# EAGLE design esp32-thing (EAGLE 7.5.0)
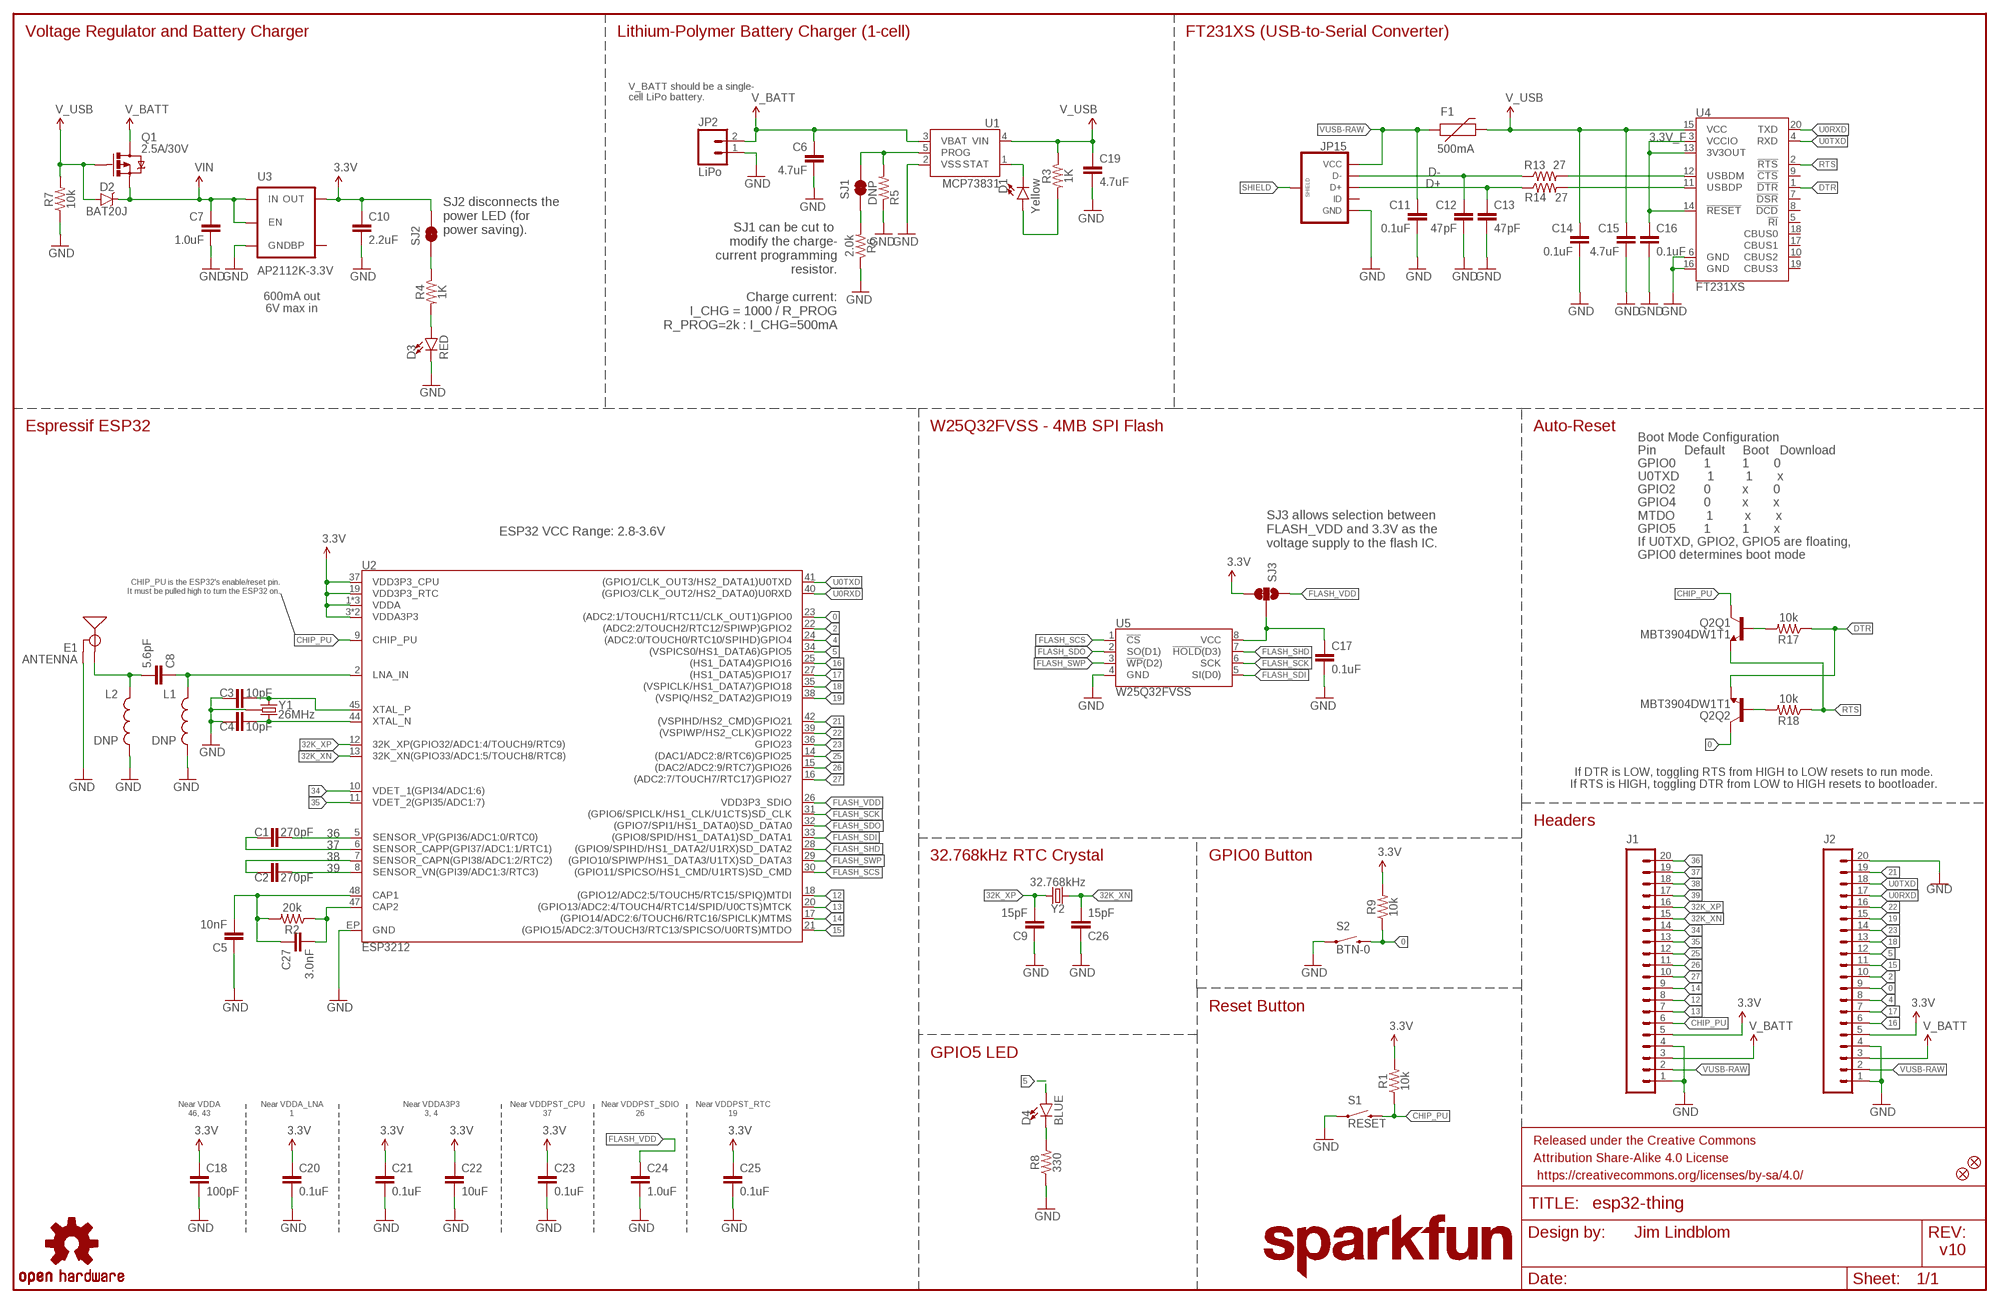
[diagram p0: schematic, sheet 1]

## Parts
C1  270pF  270PF-50V-5%(0603)  [0603]
C2  270pF  270PF-50V-5%(0603)  [0603]
C3  10pF  10PF-0603-50V-5%  [0603]
C4  10pF  10PF-0603-50V-5%  [0603]
C5  10nF  10NF-0603-50V-10%  [0603]
C6  4.7uF  4.7UF0603  [0603]
C7  1.0uF  1.0UF-0805-25V-(+80/-20%)  [0805]
C8  5.6pF  5.6PF-50V-5%(0603)  [0603]
C9  15pF  15PF-0603-50V-5%  [0603]
C10  2.2uF  2.2UF-0603-10V-20%  [0603]
C11  0.1uF  0.1UF-0603-25V-(+80/-20%)  [0603]
C12  47pF  47PF-0603-50V-5%  [0603]
C13  47pF  47PF-0603-50V-5%  [0603]
C14  0.1uF  0.1UF-0603-25V-(+80/-20%)  [0603]
C15  4.7uF  4.7UF-6.3V-10%(0603)0603  [0603-CAP]
C16  0.1uF  0.1UF-0603-25V-(+80/-20%)  [0603]
C17  0.1uF  0.1UF-0603-25V-(+80/-20%)  [0603]
C18  100pF  100PF-0603-50V-5%  [0603]
C19  4.7uF  4.7UF0603  [0603]
C20  0.1uF  0.1UF-0603-25V-(+80/-20%)  [0603]
C21  0.1uF  0.1UF-0603-25V-(+80/-20%)  [0603]
C22  10uF  10UF-0603-6.3V-20%  [0603]
C23  0.1uF  0.1UF-0603-25V-(+80/-20%)  [0603]
C24  1.0uF  1.0UF-0603-16V-10%  [0603]
C25  0.1uF  0.1UF-0603-25V-(+80/-20%)  [0603]
C26  15pF  15PF-0603-50V-5%  [0603]
C27  3.0nF  3.0NF-0603-50V-5%  [0603]
D1  Yellow  LED-YELLOW0603  [LED-0603]
D2  BAT20J  DIODE-SCHOTTKY-BAT20J  [SOD-323]
D3  RED  LED-RED0603  [LED-0603]
D4  BLUE  LED-BLUE0603  [LED-0603]
E1  ANTENNA  ANTENNATRACE-TUNED  [TRACE_ANTENNA_2.4GHZ_25.7MM_TUNED]
F1  500mA  PTCSMD  [PTC-1206]
FD1  FIDUCIALUFIDUCIAL  [MICRO-FIDUCIAL]
FD2  FIDUCIALUFIDUCIAL  [MICRO-FIDUCIAL]
FRAME1  FRAME-LEDGER  [CREATIVE_COMMONS]
J1  M20NOSILK  [1X20_NOSILK]
J2  M20NOSILK  [1X20_NOSILK]
JP2  LiPo  M02JST-PTH-2  [JST-2-PTH]
JP15  USB_MICROB_PLUGCONN-11752  [USB-B-MICRO-SMD_V03]
L1  DNP  INDUCTOR0603  [0603]
L2  DNP  INDUCTOR0603  [0603]
LOGO1  SFE_LOGO_NAME.2_INCH  [SFE_LOGO_NAME_.2]
LOGO2  OSHW-LOGOMINI  [OSHW-LOGO-MINI]
LOGO3  SFE_LOGO_NAME.2_INCH  [SFE_LOGO_NAME_.2]
Q1  2.5A/30V  MOSFET-PCHANNELDMG2307L  [SOT23-3]
Q2  MBT3904DW1T1  [SC70-6]
R1  10k  10KOHM-1/10W-1%(0603)0603  [0603]
R2  20k  20KOHM-0603-1/10W-1%  [0603]
R3  1K  1KOHM-1/10W-1%(0603)  [0603]
R4  1K  1KOHM-1/10W-1%(0603)  [0603]
R5  DNP  RESISTORPTH-1/6W  [1/6W-RES]
R6  2.0k  2.0KOHM1/10W5%(0603)  [0603]
R7  10k  10KOHM-0603-1/10W-1%  [0603]
R8  330  330OHM1/10W1%(0603)  [0603]
R9  10k  10KOHM-1/10W-1%(0603)0603  [0603]
R13  27  27OHM1/10W1%(0603)0603-RES  [0603]
R14  27  27OHM1/10W1%(0603)0603-RES  [0603]
R17  10k  10KOHM-0603-1/10W-1%  [0603]
R18  10k  10KOHM-0603-1/10W-1%  [0603]
S1  RESET  SWITCH-MOMENTARY-2SMD-4.6X2.8MM  [TACTILE_SWITCH_SMD_4.6X2.8MM]
S2  BTN-0  SWITCH-MOMENTARY-2SMD-4.6X2.8MM  [TACTILE_SWITCH_SMD_4.6X2.8MM]
SJ1  JUMPER-PAD-2-NC_BY_TRACE  [PAD-JUMPER-2-NC_BY_TRACE_YES_SILK]
SJ2  JUMPER-PAD-2-NC_BY_TRACE  [PAD-JUMPER-2-NC_BY_TRACE_YES_SILK]
SJ3  JUMPER-PAD-3-2OF3_NC_BY_TRACE_SMALL  [PAD-JUMPER-3-2OF3_NC_BY_TRACE_YES_SILK_FULL_BOX]
U1  MCP73831  [SOT23-5]
U2  ESP3212  [QFN48-0.4MM]
U3  AP2112K-3.3V  V_REG_LDOSMD  [SOT23-5]
U4  FT231XS  [SSOP20_L]
U5  W25Q32FVSS  [SOIC-8]
Y1  26MHz  CRYSTAL-GROUNDED3.2X2.5  [CRYSTAL-SMD-3.2X2.5]
Y2  32.768kHz  CRYSTAL-32.768KHZSMD-3.2X1.5  [CRYSTAL-SMD-3.2X1.5MM]

## Nets
0: J2.9 Q2.6(Q2:C) R9.1 S2.3 S2.4 U2.23((ADC2:1/TOUCH1/RTC11/CLK_OUT1)GPIO0)
2: J2.10 U2.22((ADC2:2/TOUCH2/RTC12/SPIWP)GPIO2)
3.3V: C10.1 C18.1 C20.1 C21.1 C22.1 C23.1 C25.1 J1.5 J2.5 R1.2 R9.2 SJ2.2 SJ3.3 U2.1(VDDA) U2.3(VDDA3P3) U2.4(VDDA3P3) U2.19(VDD3P3_RTC) U2.37(VDD3P3_CPU) U2.43(VDDA) U2.46(VDDA) U3.5(OUT)
3.3V_F: C16.1 U4.3(VCCIO) U4.13(3V3OUT) U4.14(!RESET)
4: J2.8 U2.24((ADC2:0/TOUCH0/RTC10/SPIHD)GPIO4)
5: D4.A J2.12 U2.34((VSPICS0/HS1_DATA6)GPIO5)
12: J1.8 U2.18((GPIO12/ADC2:5/TOUCH5/RTC15/SPIQ)MTDI)
13: J1.7 U2.20((GPIO13/ADC2:4/TOUCH4/RTC14/SPID/U0CTS)MTCK)
14: J1.9 U2.17((GPIO14/ADC2:6/TOUCH6/RTC16/SPICLK)MTMS)
15: J2.11 U2.21((GPIO15/ADC2:3/TOUCH3/RTC13/SPICSO/U0RTS)MTDO)
16: J2.6 U2.25((HS1_DATA4)GPIO16)
17: J2.7 U2.27((HS1_DATA5)GPIO17)
18: J2.13 U2.35((VSPICLK/HS1_DATA7)GPIO18)
19: J2.15 U2.38((VSPIQ/HS2_DATA2)GPIO19)
21: J2.19 U2.42((VSPIHD/HS2_CMD)GPIO21)
22: J2.16 U2.39((VSPIWP/HS2_CLK)GPIO22)
23: J2.14 U2.36(GPIO23)
25: J1.12 U2.14((DAC1/ADC2:8/RTC6)GPIO25)
26: J1.11 U2.15((DAC2/ADC2:9/RTC7)GPIO26)
27: J1.10 U2.16((ADC2:7/TOUCH7/RTC17)GPIO27)
32K_XN: C26.2 J1.15 U2.13(32K_XN(GPIO33/ADC1:5/TOUCH8/RTC8)) Y2.P$2
32K_XP: C9.2 J1.16 U2.12(32K_XP(GPIO32/ADC1:4/TOUCH9/RTC9)) Y2.P$1
34: J1.14 U2.10(VDET_1(GPI34/ADC1:6))
35: J1.13 U2.11(VDET_2(GPI35/ADC1:7))
36: C1.2 J1.20 U2.5(SENSOR_VP(GPI36/ADC1:0/RTC0))
37: C1.1 J1.19 U2.6(SENSOR_CAPP(GPI37/ADC1:1/RTC1))
38: C2.1 J1.18 U2.7(SENSOR_CAPN(GPI38/ADC1:2/RTC2))
39: C2.2 J1.17 U2.8(SENSOR_VN(GPI39/ADC1:3/RTC3))
CAP_10N: C5.2 C27.1 R2.2 U2.48(CAP1)
CHIP_PU: J1.6 Q2.3(Q1:C) R1.1 S1.3 S1.4 U2.9(CHIP_PU)
D+: C13.1 JP15.D+ R14.1
D-: C12.1 JP15.D- R13.1
DTR: Q2.1(Q2:E) R17.1 U4.1(!DTR)
FLASH_SCK: U2.31((GPIO6/SPICLK/HS1_CLK/U1CTS)SD_CLK) U5.6(SCK)
FLASH_SCS: U2.30((GPIO11/SPICSO/HS1_CMD/U1RTS)SD_CMD) U5.1(!CS!)
FLASH_SDI: U2.33((GPIO8/SPID/HS1_DATA1)SD_DATA1) U5.5(SI(D0))
FLASH_SDO: U2.32((GPIO7/SPI1/HS1_DATA0)SD_DATA0) U5.2(SO(D1))
FLASH_SHD: U2.28((GPIO9/SPIHD/HS1_DATA2/U1RX)SD_DATA2) U5.7(!HOLD!(D3))
FLASH_SWP: U2.29((GPIO10/SPIWP/HS1_DATA3/U1TX)SD_DATA3) U5.3(!WP!(D2))
FLASH_VDD: C24.1 SJ3.1 U2.26(VDD3P3_SDIO)
GND: C3.1 C4.1 C5.1 C6.2 C7.2 C9.1 C10.2 C11.2 C12.2 C13.2 C14.2 C15.2 C16.2 C17.2 C18.2 C19.2 C20.2 C21.2 C22.2 C23.2 C24.2 C25.2 C26.1 D3.C E1.GND E1.GND2(GND) J1.1 J1.4 J2.1 J2.4 J2.20 JP2.1 JP15.GND L1.2 L2.2 R5.1 R6.1 R7.1 R8.1 S1.1 S1.2 S2.1 S2.2 U1.2(VSS) U2.EP(GND) U3.2(GND) U4.6(GND) U4.16(GND) U5.4(GND) Y1.2(GND) Y1.4(GND)
LNA_IN: C8.1 L1.1 U2.2(LNA_IN)
N$1: D4.C R8.2
N$2: D3.A R4.2
N$3: R4.1 SJ2.1
N$4: C27.2 R2.1 U2.47(CAP2)
N$7: R13.2 U4.12(USBDM)
N$8: R14.2 U4.11(USBDP)
N$9: D1.C U1.1(STAT)
N$10: Q2.5(Q1:B) R17.2
N$11: C17.1 SJ3.2 U5.8(VCC)
N$12: Q2.2(Q2:B) R18.2
N$13: C3.2 U2.45(XTAL_P) Y1.1
N$14: R5.2 SJ1.2 U1.5(PROG)
N$15: C4.2 U2.44(XTAL_N) Y1.3
N$16: R6.2 SJ1.1
N$17: D1.A R3.2
RTS: Q2.4(Q1:E) R18.1 U4.2(!RTS)
SHIELD: JP15.SHIELD1(SHIELD) JP15.SHIELD2(SHIELD) JP15.SHIELD3(SHIELD)
TRACE_ANT: C8.2 E1.ANT(SIGNAL) L2.1
U0RXD: J2.17 U2.40((GPIO3/CLK_OUT2/HS2_DATA0)U0RXD) U4.20(TXD)
U0TXD: J2.18 U2.41((GPIO1/CLK_OUT3/HS2_DATA1)U0TXD) U4.4(RXD)
V_BATT: C6.1 J1.3 J2.3 JP2.2 Q1.3(D) U1.3(VBAT)
V_USB: C14.1 C15.1 C19.1 D2.A F1.2 Q1.1(G) R3.1 R7.2 U1.4(VIN) U4.15(VCC)
VIN: C7.1 D2.C Q1.2(S) U3.1(IN) U3.3(EN)
VUSB-RAW: C11.1 F1.1 J1.2 J2.2 JP15.VBUS(VCC)
Unconnected: JP15.ID U3.4(BP) U4.5(!RI) U4.7(!DSR) U4.8(!DCD) U4.9(!CTS) U4.10(CBUS2) U4.17(CBUS1) U4.18(CBUS0) U4.19(CBUS3)

## Notes on the sheet
- Voltage Regulator and Battery Charger | Lithium-Polymer Battery Charger (1-cell) | FT231XS (USB-to-Serial Converter)
- V_BATT should be a single-
  cell LiPo battery.
- SJ1 can be cut to 
  modify the charge-
  current programming
  resistor.
- SJ2 disconnects the
  power LED (for 
  power saving).
- 600mA out
  6V max in
- Charge current:
  I_CHG = 1000 / R_PROG
  R_PROG=2k : I_CHG=500mA
- Espressif ESP32 | W25Q32FVSS - 4MB SPI Flash | Auto-Reset
- ESP32 VCC Range: 2.8-3.6V
- SJ3 allows selection between 
  FLASH_VDD and 3.3V as the
  voltage supply to the flash IC.
- Boot Mode Configuration
  Pin        Default     Boot   Download
  GPIO0        1         1       0
  U0TXD        1         1       x
  GPIO2        0         x       0
  GPIO4        0         x       x
  MTDO         1         x       x
  GPIO5        1         1       x
  If U0TXD, GPIO2, GPIO5 are floating, 
  GPIO0 determines boot mode
- CHIP_PU is the ESP32's enable/reset pin.
  It must be pulled high to turn the ESP32 on.
- If DTR is LOW, toggling RTS from HIGH to LOW resets to run mode.
  If RTS is HIGH, toggling DTR from LOW to HIGH resets to bootloader.
- Headers
- 32.768kHz RTC Crystal | GPIO0 Button
- Reset Button
- GPIO5 LED
- Near VDDA
  46, 43
- Near VDDA_LNA
  1
- Near VDDA3P3
  3, 4
- Near VDDPST_CPU
  37
- Near VDDPST_SDIO
  26
- Near VDDPST_RTC
  19
- Jim Lindblom
- v10

## Library data of the parts
C1 C2 = esp32-thing-temp:270PF-50V-5%(0603): CAP-13339; PROD_ID: CAP-13339
C3 C4 = SparkFun-Capacitors:10PF: 10pF ceramic capacitors A capacitor is a passive two-terminal electrical component used to store electrical energy temporarily in an electric field.; PROD_ID: CAP-11812
C5 = SparkFun-Capacitors:10NF: 0.01uF/10nF/10,000pF ceramic capacitors A capacitor is a passive two-terminal electrical component used to store electrical energy temporarily in an electric field. CAP-09321; PROD_ID: CAP-00867
C6 C19 = SparkFun-Capacitors:4.7UF: 4.7µF ceramic capacitors A capacitor is a passive two-terminal electrical component used to store electrical energy temporarily in an electric field.; PROD_ID: CAP-08280
C7 = SparkFun-Capacitors:1.0UF: 1µF ceramic capacitors A capacitor is a passive two-terminal electrical component used to store electrical energy temporarily in an electric field.; PROD_ID: CAP-11625
C8 = esp32-thing-temp:5.6PF-50V-5%(0603): CAP-12456; PROD_ID: CAP-12456
C9 C26 = SparkFun-Capacitors:15PF: 15pF ceramic capacitors A capacitor is a passive two-terminal electrical component used to store electrical energy temporarily in an electric field.; PROD_ID: CAP-07881
C10 = SparkFun-Capacitors:2.2UF: 2.2µF ceramic capacitors A capacitor is a passive two-terminal electrical component used to store electrical energy temporarily in an electric field.; PROD_ID: CAP-07888
C11 C14 C16 C17 C20 C21 C23 C25 = SparkFun-Capacitors:0.1UF: 0.1µF ceramic capacitors A capacitor is a passive two-terminal electrical component used to store electrical energy temporarily in an electric field.; PROD_ID: CAP-00810
C12 C13 = SparkFun-Capacitors:47PF: 47pF ceramic capacitors A capacitor is a passive two-terminal electrical component used to store electrical energy temporarily in an electric field.; PROD_ID: CAP-08913
C15 = SparkFun-Capacitors:4.7UF-6.3V-10%(0603): CAP-08280; PROD_ID: CAP-08280
C18 = SparkFun-Capacitors:100PF: 100pF/0.1nF ceramic capacitors A capacitor is a passive two-terminal electrical component used to store electrical energy temporarily in an electric field.; PROD_ID: CAP-07883
C22 = SparkFun-Capacitors:10UF: 10.0µF ceramic capacitors A capacitor is a passive two-terminal electrical component used to store electrical energy temporarily in an electric field.; PROD_ID: CAP-11015
C24 = SparkFun-Capacitors:1.0UF: 1µF ceramic capacitors A capacitor is a passive two-terminal electrical component used to store electrical energy temporarily in an electric field.; PROD_ID: CAP-00868
C27 = esp32-thing-temp:3.0NF: 3.0nF (3nF, 3000pF) ceramic capacitors A capacitor is a passive two-terminal electrical component used to store electrical energy temporarily in an electric field.; PROD_ID: CAP-13515
D1 = SparkFun-LED:LED-YELLOW: Yellow SMD LEDs LilyPad 1206- DIO-09909 0603- DIO-09003 "SMART" means more efficient and expensive; PROD_ID: DIO-09003
D2 = SparkFun-DiscreteSemi:DIODE-SCHOTTKY: Schottky diodes in SFE's production catalog BAT20J 1A 23V 0.62Vf RB751 120mA 40V 0.37Vf PMEG4005EJ 0.5A 40V 0.42Vf MBRA140 1A 40V 0.5Vf B340A 3A 40V SMA; PROD_ID: DIO-11623
D3 = SparkFun-LED:LED-RED: Red SMD LED Used in manufacturing of most products at SparkFun 0603 - SMD 0603 package Forward Voltage: 1.9V Forward Current: 20mA Datasheet: [Product Link] <http://docs.avagotech.com/docs/AV02-0551EN> 0603 SMART - SMD 0603 SMART package ( more efficient and expensive) Forward Voltage: 1.8V Forward Current: 20mA Datasheet: [Product Link] <http://www.osram-os.com/Graphics/XPic2/00077099_0.pdf> 1206 - SMD 1206 package Forward Voltage: 2V Forward Current: 20mA Datasheet: [Product Link] <https://www.sparkfun.com/datasheets/DevTools/LilyPad/Q150OVS4.pdff> 1206 LilyPad - SMD 1206 LilyPad package Forward Voltage: 2V Forward Current: 20mA Datasheet: [Product Link] <https://www.sparkfun.com/datasheets/DevTools/LilyPad/Q150OVS4.pdf>; PROD_ID: DIO-00819
D4 = SparkFun-LED:LED-BLUE: Blue SMD LED Used in manufacturing of various products at SparkFun 0603 - SMD 0603 package Manufacturer: Rohm Semiconductor Forward Voltage: 2.9V Forward Current: 5mA Wavelength: 470nm Digikey: [Product Link] <http://www.digikey.com/product-detail/en/SMLE12BC7TT86/511-1589-2-ND/1641808> 1206 - SMD1206 package Manufacturer:Lite-On Inc. Forward Voltage: 3.3V Forward Current: 20mA Wavelength: 468nm Digikey: [Product Link] <http://www.digikey.com/product-detail/en/lite-on-inc/LTST-C150TBKT/160-1643-1-ND/573584>; PROD_ID: DIO-08575
E1 = esp32-thing-temp:ANTENNA: Chip antenna Chip antenna with ground or secondary connection. Common with larger metal RF connectors.
F1 = SparkFun-PowerIC:PTC: Resettable Fuse PTC Resettable Fuse. Spark Fun Electronics SKU : COM-08357; PROD_ID: RES-11150
FD1 FD2 = SparkFun-Aesthetics:FIDUCIAL: Fiducial Alignment Points Various fiducial points for machine vision alignment.
FRAME1 = SparkFun-Aesthetics:FRAME-LEDGER: Schematic Frame Standard 11x14 US Ledger frame
J1 J2 = SparkFun-Connectors:M20: 1x20 .1" header This is just like the LOCK variant in that the holes are staggared by 5 mil, but except for the last two holes. They are not altered from the "standard" footprint layout. This is used for a special purpose on the layout of our Graphic LCD Backpack. Make sure you want to use this device before selecting it for you project!
JP2 = SparkFun-Connectors:M02: Standard 2-pin 0.1" header. Use with - straight break away headers ( PRT-00116) - right angle break away headers (PRT-00553) - swiss pins (PRT-00743) - machine pins (PRT-00117) - female headers (PRT-00115) Molex polarized connector foot print use with: PRT-08233 with associated crimp pins and housings. 2.54_SCREWTERM for use with PRT-10571. 3.5mm Screw Terminal footprints for PRT-08084 5mm Screw Terminal footprints for use with PRT-08432; PROD_ID: CONN-09863; SKU: PRT-09914
JP15 = SparkFun-Connectors:USB_MICROB_PLUG: USB Micro-B connectors Some male, some female. Watch your step!; PROD_ID: CONN-11752
L1 L2 = SparkFun-Passives:INDUCTOR: Inductors Basic Inductor/Choke - 0603 and 1206. Footprints are not proven and vary greatly between part numbers. INDUCTOR POWER 3.3UH 4.0A SMD 0.197" L x 0.197" W x 0.177" H (5.00mm x 5.00mm x 4.50mm)
LOGO1 LOGO3 = SparkFun-Aesthetics:SFE_LOGO_NAME: SFE Logo, name only This is the SparkFun name logo. The logo on the schematic will always be the same size; the package variant is the height of the flame part of the logo (or the height the flame would be, if it were drawn). Default layer for the logo on the board is tSilk.
LOGO2 = SparkFun-Aesthetics:OSHW-LOGO: Open Source Hardware Logo This logo indicates the piece of hardware it is found on incorporates a OSHW license and/or adheres to the definition of open source hardware found here: http://freedomdefined.org/OSHW
Q1 = SparkFun-DiscreteSemi:MOSFET-PCHANNEL: Generic PMOSFET IRLML2244 - TRANS-11153 (SOT-23 -20V -4.3A) (1.Gate 2.Source 3.Drain) FQP27P06 - COM-10349 <http://www.sparkfun.com/products/10349> (TO-220 -60V -27A) (1.Gate 2.Source 3.Drain); PROD_ID: TRANS-11308
Q2 = esp32-thing-temp:MBT3904DW1T1: MBT3904DW1 Dual NPN Transistors The MBT3904W1 puts two general purpose 3904 NPN transistors in a single package. Datasheet <http://www.onsemi.com/pub_link/Collateral/MBT3904DW1T1-D.PDF>; PROD_ID: TRANS-13337
R1 R9 = SparkFun-Resistors:10KOHM-1/10W-1%(0603): RES-00824; PROD_ID: RES-00824; VALUE: 10K
R2 = SparkFun-Resistors:20KOHM: 20kΩ resistor A resistor is a passive two-terminal electrical component that implements electrical resistance as a circuit element. Resistors act to reduce current flow, and, at the same time, act to lower voltage levels within circuits. - Wikipedia; PROD_ID: RES-09383
R3 R4 = SparkFun-Resistors:1KOHM-1/10W-1%(0603): RES-07856; PROD_ID: RES-07856
R5 = SparkFun-Passives:RESISTOR: Resistor Basic schematic elements and footprints for 0603, 1206, and PTH resistors.
R6 = SparkFun-Resistors:2.0KOHM1/10W5%(0603): RES-08296; PROD_ID: RES-08296
R7 R17 R18 = SparkFun-Resistors:10KOHM: 10kΩ resistor A resistor is a passive two-terminal electrical component that implements electrical resistance as a circuit element. Resistors act to reduce current flow, and, at the same time, act to lower voltage levels within circuits. - Wikipedia; PROD_ID: RES-00824
R8 = SparkFun-Resistors:330OHM1/10W1%(0603): RES-00818; PROD_ID: RES-00818
R13 R14 = SparkFun-Resistors:27OHM1/10W1%(0603): RES-09334; PROD_ID: RES-09334
S1 S2 = SparkFun-Electromechanical:SWITCH-MOMENTARY-2: Various NO switches- pushbuttons, reed, etc; PROD_ID: SWCH-13065
SJ1 SJ2 = SparkFun-Passives:JUMPER-PAD-2-NC_BY_TRACE
SJ3 = SparkFun-Passives:JUMPER-PAD-3-2OF3_NC_BY_TRACE
U1 = SparkFun-PowerIC:MCP73831: Miniature single cell, fully integrated Li-Ion, Li-polymer charge management controller http://ww1.microchip.com/downloads/en/DeviceDoc/20001984g.pdf IC-09995; PROD_ID: IC-09995
U2 = esp32-thing-temp:ESP3212; PROD_ID: IC-13338
U3 = SparkFun-PowerIC:V_REG_LDO: Voltage Regulator LDO Standard 150mA LDO voltage regulator in SOT-23 layout. Micrel part MIC5205. BP (by-pass) pin is used to lower output noise with 470pF cap.; PROD_ID: VREG-12457
U4 = SparkFun-DigitalIC:FT231X: FTDI FT231X Full Speed USB to Full-handshake UART This USB2.0 Full Speed IC offers a compact bridge to full handshake UART interfaces. The device is a UART, capable of operating up to 3MBaud, with low power consumption (8mA). The FT231X includes the complete FT-X series feature set and enables USB to be added into a system design quickly and easily over a UART interface.; PROD_ID: IC-11524
U5 = SparkFun-DigitalIC:W25Q32FV: Winbond W25Q32FV 32Mbit (4MB) Flash The W25Q32FV support the standard Serial Peripheral Interface (SPI), Dual/Quad I/O SPI as well as 2-clocks instruction cycle Quad Peripheral Interface (QPI). Datasheet <http://www.winbond.com/resource-files/w25q32fv%20revh%20091613.pdf>; PROD_ID: IC-13229
Y1 = things:CRYSTAL-GROUNDED; PROD_ID: XTAL-12454
Y2 = SparkFun-Clocks:CRYSTAL-32.768KHZ: 32.768kHz Crystal Frequency: 32.768kHz Frequency Stability: ±20ppm Load Capacitance: 12.5pF (PTH-2X6 & SMD-3.2X1.5), 6pF (SMD-2X6); PROD_ID: XTAL-13062

## Board
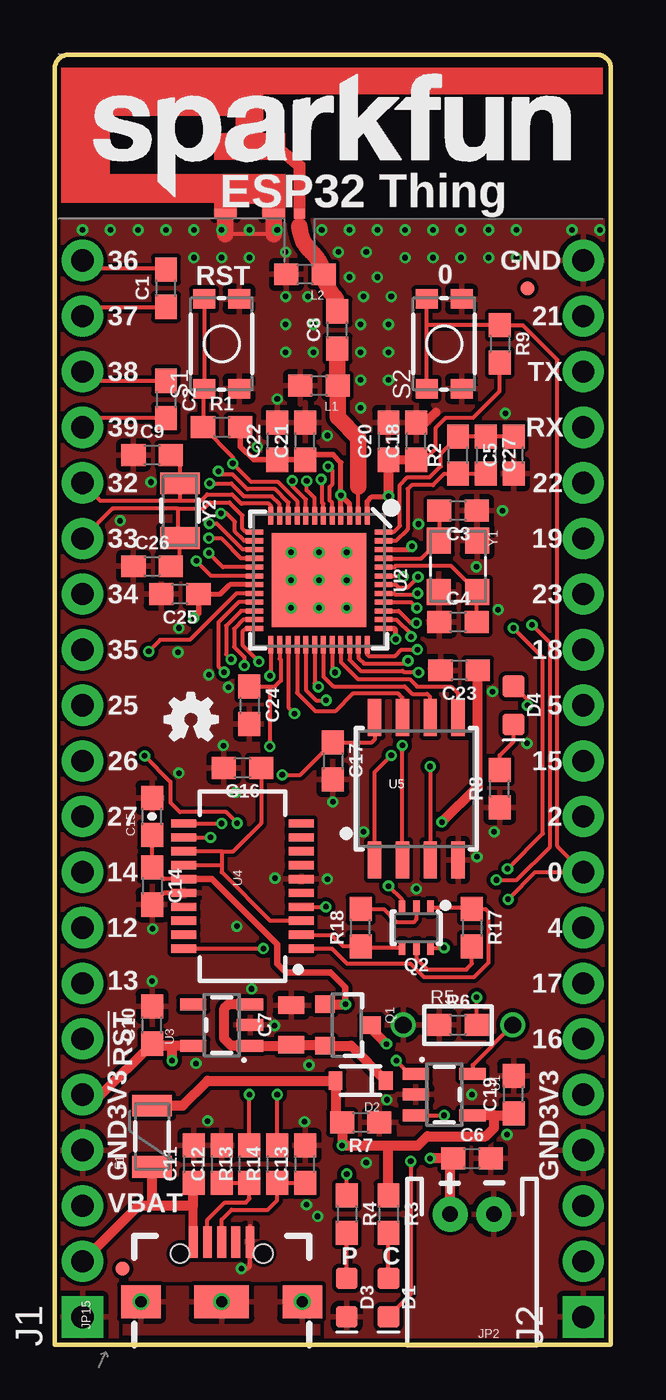
[diagram p1: board, top side]
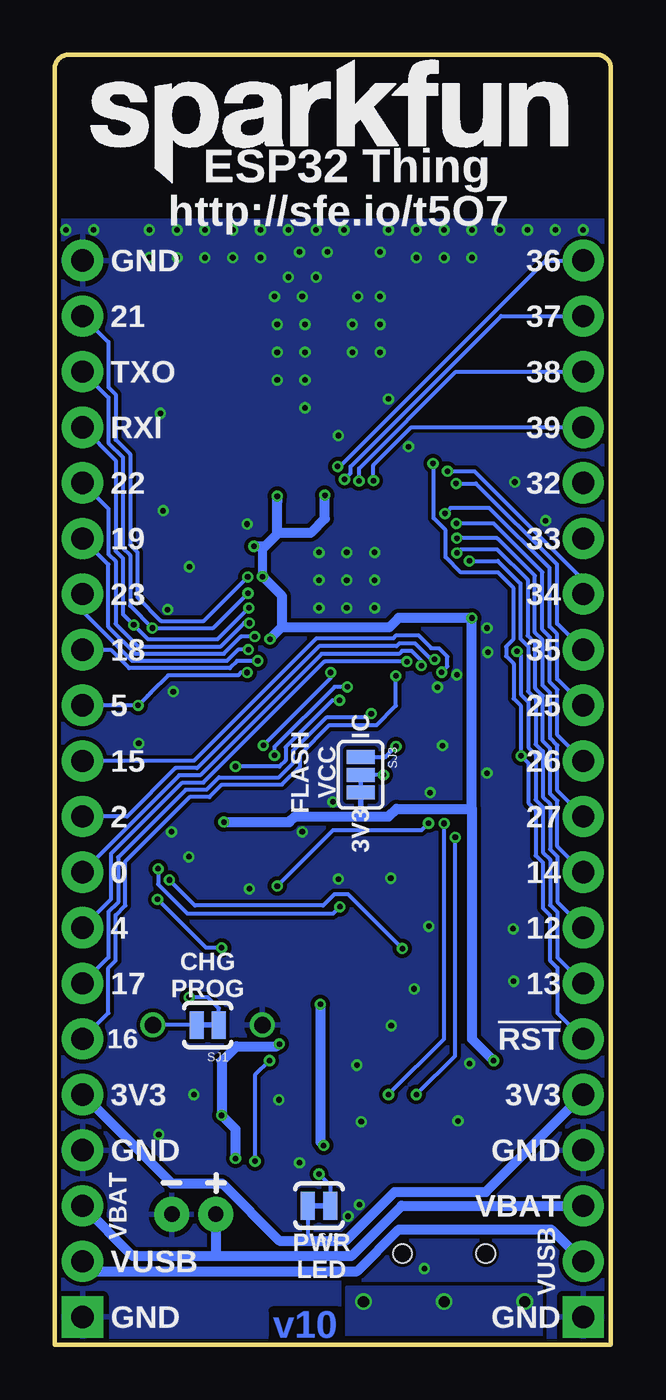
[diagram p2: board, bottom side, seen from below]

Size 25.4 x 58.93 mm. Coordinates in mm from the lower left corner, seen from the top.
Outline: 0,0 0,58.29 arc-90 0.64,58.93 24.77,58.93 arc-90 25.4,58.29 25.4,0 0,0
Copper layers (1*16): Top 0.035mm / dielectric 1.5mm / Bottom 0.035mm
Design rules "SparkFun-2-layer-FAB-LIMIT *": minimum track width 6mil, minimum drill 6mil, track to track 6mil, track to pad 6mil, pad to pad 6mil, via to via 6mil, smd to smd 6mil, copper to edge 4mil, drill to drill 4mil, minimum pad ring 5mil, minimum via ring 5mil, stop-mask expansion 4mil, vias tented up to drill 25mil, thermal gap 10mil

### Footprints (pad centres in the part's own frame; a part is rotated, then mirrored left to right if it is on the bottom)
0603 = smd 1.1 x 1: 1 -0.85,0; 2 0.85,0
0805 = smd 0.8 x 1.2: 1 -0.9,0; 2 0.9,0
0603-CAP = smd 1.1 x 1: 1 -0.85,0; 2 0.85,0
LED-0603 = smd 1 x 1: A 0,-0.877; C 0,0.877
SOD-323 = smd 0.63 x 0.83: A 1.15,0; C -1.15,0
TRACE_ANTENNA_2.4GHZ_25.7MM_TUNED = smd 0.46 x 0.46: ANT 0,0.23 | smd 1 x 0.46: GND -1.18,0.23; GND2 -3.38,0.23
PTC-1206 = smd 1 x 1.8: 1 -1.4,0; 2 1.4,0
MICRO-FIDUCIAL = smd 0.635 x 0.635: 1 0,0
1X20_NOSILK = drill 1.016 pad 1.88 square: 1 0,0 | drill 1.016 pad 1.88: 2 2.54,0; 3 5.08,0; 4 7.62,0; 5 10.16,0; 6 12.7,0; 7 15.24,0; 8 17.78,0; 9 20.32,0; 10 22.86,0; 11 25.4,0; 12 27.94,0; 13 30.48,0; 14 33.02,0; 15 35.56,0; 16 38.1,0; 17 40.64,0; 18 43.18,0; 19 45.72,0; 20 48.26,0
JST-2-PTH = drill 0.7 pad 1.6: 1 -1,0; 2 1,0
USB-B-MICRO-SMD_V03 = smd 1.45 x 0.4: D+ 2.725,0; D- 2.725,0.65; GND 2.725,-1.3; ID 2.725,-0.65; VBUS 2.725,1.3 | smd 1.5 x 1.8: SHIELD1 0,3.685; SHIELD2 0,-3.685 | smd 1.5 x 2.5: SHIELD3 0,0 | hole 0.85: 2.2,1.9; 2.2,-1.9
SOT23-3 = smd 0.8 x 0.9: 1 -0.95,-1; 2 0.95,-1; 3 0,1.1
SC70-6 = smd 0.3 x 0.66: 1 -0.65,-0.92; 2 0,-0.92; 3 0.65,-0.92; 4 0.65,0.92; 5 0,0.92; 6 -0.65,0.92
1/6W-RES = drill 0.762: 1 -2.5,0; 2 2.5,0
TACTILE_SWITCH_SMD_4.6X2.8MM = smd 0.9 x 1: 1 -2.05,-0.8; 2 2.05,-0.8; 3 2.05,0.8; 4 -2.05,0.8
PAD-JUMPER-2-NC_BY_TRACE_YES_SILK = smd 0.635 x 1.27: 1 -0.508,0; 2 0.508,0
PAD-JUMPER-3-2OF3_NC_BY_TRACE_YES_SILK_FULL_BOX = smd 0.635 x 1.27: 1 -0.813,0; 2 0,0; 3 0.813,0
SOT23-5 = smd 0.55 x 1.2: 1 -0.95,-1.3; 2 0,-1.3; 3 0.95,-1.3; 4 0.95,1.3; 5 -0.95,1.3
QFN48-0.4MM = smd 0.8 x 0.23: 1 -2.95,2.2; 2 -2.95,1.8; 3 -2.95,1.4; 4 -2.95,1; 5 -2.95,0.6; 6 -2.95,0.2; 7 -2.95,-0.2; 8 -2.95,-0.6; 9 -2.95,-1; 10 -2.95,-1.4; 11 -2.95,-1.8; 12 -2.95,-2.2; 25 2.95,-2.2; 26 2.95,-1.8; 27 2.95,-1.4; 28 2.95,-1; 29 2.95,-0.6; 30 2.95,-0.2; 31 2.95,0.2; 32 2.95,0.6; 33 2.95,1; 34 2.95,1.4; 35 2.95,1.8; 36 2.95,2.2 | smd 0.23 x 0.8: 13 -2.2,-2.95; 14 -1.8,-2.95; 15 -1.4,-2.95; 16 -1,-2.95; 17 -0.6,-2.95; 18 -0.2,-2.95; 19 0.2,-2.95; 20 0.6,-2.95; 21 1,-2.95; 22 1.4,-2.95; 23 1.8,-2.95; 24 2.2,-2.95; 37 2.2,2.95; 38 1.8,2.95; 39 1.4,2.95; 40 1,2.95; 41 0.6,2.95; 42 0.2,2.95; 43 -0.2,2.95; 44 -0.6,2.95; 45 -1,2.95; 46 -1.4,2.95; 47 -1.8,2.95; 48 -2.2,2.95 | smd 4.3 x 4.3: EP 0,0
SSOP20_L = smd 0.381 x 1.143: 1 -2.857,-2.68; 2 -2.223,-2.68; 3 -1.587,-2.68; 4 -0.953,-2.68; 5 -0.318,-2.68; 6 0.318,-2.68; 7 0.953,-2.68; 8 1.587,-2.68; 9 2.223,-2.68; 10 2.857,-2.68; 11 2.857,2.68; 12 2.223,2.68; 13 1.587,2.68; 14 0.953,2.68; 15 0.318,2.68; 16 -0.318,2.68; 17 -0.953,2.68; 18 -1.587,2.68; 19 -2.223,2.68; 20 -2.857,2.68
SOIC-8 = smd 0.61 x 1.702: 1 -1.905,-3.251; 2 -0.635,-3.251; 3 0.635,-3.251; 4 1.905,-3.251; 5 1.905,3.251; 6 0.635,3.251; 7 -0.635,3.251; 8 -1.905,3.251
CRYSTAL-SMD-3.2X2.5 = smd 1.2 x 1.1: 1 -1.175,-0.875; 2 1.175,-0.875; 3 1.175,0.875; 4 -1.175,0.875
CRYSTAL-SMD-3.2X1.5MM = smd 1 x 1.8: P$1 -1.25,0; P$2 1.25,0

### Placement (x,y rotation side)
C1  5.08,48.26 90 top
C2  5.08,43.18 270 top
C3  18.41,38.1 180 top
C4  18.41,33.02 0 top
C5  20.95,40.64 90 top
C6  19.05,8.51 0 top
C7  10.79,14.61 90 top
C8  12.9,46.35 90 top
C9  4.45,40.64 0 top
C10  4.45,14.61 90 top
C11  6.35,8.26 90 top
C12  7.62,8.26 90 top
C13  11.43,8.26 90 top
C14  4.45,20.95 270 top
C15  4.45,24.13 90 top
C16  8.57,26.35 180 top
C17  12.7,26.67 270 top
C18  16.51,41.27 90 top
C19  20.95,11.43 90 top
C20  15.24,41.27 90 top
C21  11.43,41.27 90 top
C22  10.16,41.27 90 top
C23  18.47,30.81 180 top
C24  8.89,29.21 270 top
C25  5.71,34.29 180 top
C26  4.45,35.56 0 top
C27  19.68,40.64 270 top
D1  15.24,2.16 180 top
D2  13.97,12.06 180 top
D3  13.34,2.16 180 top
D4  20.95,29.21 180 top
E1  11.18,51.44 0 top
F1  4.45,9.53 90 top
FD1  3.1,3.48 0 top
FD2  21.59,48.26 0 top
FRAME1  -17.14,-19.05 0 top  (outside the outline)
J1  1.27,1.27 90 top
J2  24.13,1.27 90 top
JP2  19.05,5.97 180 top
JP15  7.62,1.97 90 top
L1  12.06,43.81 180 top
L2  11.43,48.9 180 top
LOGO1  1.78,52.45 0 top
LOGO2  6.22,28.57 0 top
LOGO3  23.75,53.09 0 bottom
Q1  13.34,14.61 270 top
Q2  16.51,19.05 180 top
R1  7.62,41.91 0 top
R2  18.41,40.64 90 top
R3  15.24,5.97 270 top
R4  13.34,5.97 270 top
R5  18.41,14.61 0 top
R6  18.41,14.61 0 top
R7  13.97,10.16 180 top
R8  20.32,25.4 90 top
R9  20.32,45.72 270 top
R13  8.89,8.26 90 top
R14  10.16,8.26 90 top
R17  19.05,19.05 270 top
R18  13.97,19.05 90 top
S1  7.62,45.72 90 top
S2  17.78,45.72 90 top
SJ1  18.41,14.61 180 bottom
SJ2  13.34,6.35 180 bottom
SJ3  11.43,26.04 270 bottom
U1  17.78,11.43 270 top
U2  12.06,34.92 270 top
U3  7.62,14.61 90 top
U4  8.57,20.95 90 top
U5  16.51,25.4 0 top
Y1  18.41,35.56 270 top
Y2  5.71,38.1 270 top

### Tracks (layer width: path | path; a pad name or v marks a point on that pad's centre or on a via)
0  (via drill 0.25)
  Top 0.178: U2.23 8.61,33.12 8.19,32.7 8.19,31.88 8.66,31.41 v8.66,31.03 | Q2.6 v17.78,18.13 | S2.4 16.98,46.57 | 16.98,46.57 S2.3 | 16.98,46.57 R9.1 21.38,46.57 22.95,45 22.95,22.77 J2.9 21.95,21.59 v20.71,20.34
  Bottom 0.178: 22.95,22.77 J2.9 24.13,21.6 19.72,26.01 18.76,26.01 13.21,31.56 9.68,31.56 9.54,31.7 9.11,31.7 8.66,31.25 v8.66,31.03 | v17.78,18.13 18.49,18.13 v20.71,20.34
2  (via drill 0.25)
  Top 0.178: U2.22 8.51,33.52 7.82,32.84 7.82,31.53 v8.05,31.3
  Bottom 0.178: v8.05,31.3 8.2,31.3 8.95,32.05 9.65,32.05 9.79,31.91 13.32,31.91 18.9,26.34 19.89,26.34 22.1,24.13 J2.10
3.3V  (via drill 0.25)
  Top 0.178: 4.54,13.65 C10.1 | 6.35,34.08 C25.1 | 15.21,38.73 v15.24,38.76 | R9.2 20.32,43.56 19.1,42.34 17.86,42.34 17.4,41.88 17.4,40.95 16.88,40.42 C18.1 | U2.43 15.88,35.12 v15.91,35.09
  Top 0.229: U2.19 7.99,34.73 7.56,34.29 C25.1 | U2.1 14.27,38.52 14.48,38.73 15.21,38.73 | U2.46 16.16,36.33 v16.31,36.47 | 15.1,32.73 U2.37 15.5,32.73 15.57,32.65 v15.57,32.23 | 12.71,40.65 13.06,40.3 v13.06,38.81 | U2.4 v13.06,38.81 | U2.3 13.46,38.41 v13.06,38.81
  Top 0.254: 12.71,40.65 11.66,40.65 C21.1 C22.1 9.08,40.42 8.47,41.03 R1.2 | v6.35,33.2 6.57,33.41 C25.1
  Top 0.406: C20.1 C18.1
  Top 0.457: U3.5 5.36,13.65 | 5.36,13.65 4.54,13.65 | C20.1 v15.24,38.76 | 19.3,30.81 C23.1 19.32,25.51 v17.68,23.88 | v5.36,12.98 5.36,13.65 | J1.5 2.12,11.43 C10.1
  Bottom 0.178: SJ2.2 13.84,4.75 14.02,4.75
  Bottom 0.254: SJ3.3 11.43,24.13
  Bottom 0.406: 15.88,36.47 15.8,36.47 | v15.91,35.09 15.91,36.47 v16.31,36.47
  Bottom 0.457: J2.5 20.07,7.37 17.75,7.37 15.14,4.75 14.02,4.75 12.12,4.75 9.88,6.99 5.71,6.99 J1.5 | 15.24,38.48 v15.24,38.76 15.24,37.03 | v16.31,36.47 15.8,36.47 15.24,37.03 | 6.35,24.49 6.35,13.97 v5.36,12.98 | 6.35,24.49 9.8,24.49 10.16,24.13 11.43,24.13 14.43,24.13 14.68,23.88 v17.68,23.88 | 6.35,24.49 v6.35,33.2 9.7,33.2 10.13,32.77 15.02,32.77 15.02,32.81 | v15.91,35.09 15.02,34.19 15.02,32.81 | 15.02,32.81 15.57,32.26 v15.57,32.23 | 15.24,37.03 15.19,37.08 13.72,37.08 13.06,37.73 v13.06,38.81
3.3V_F
  Top 0.178: U4.3 9.84,19.37 7.62,21.59 7.62,21.91 | U4.14 7.62,21.91 | 7.62,22.54 U4.13 | C16.1 9.42,23.82 8.14,22.54 7.62,22.54 | 7.62,22.54 7.62,21.91
4  (via drill 0.25)
  Top 0.178: U2.24 8.72,32.73 8.57,32.58 8.57,31.97 9.32,31.22 v9.32,31.2
  Bottom 0.178: J2.8 22.84,20.34 22.84,22.42 19.57,25.68 18.62,25.68 13.09,31.2 v9.32,31.2
5  (via drill 0.25)
  Top 0.178: U2.34 13.46,31.29 13.97,30.79 15.88,30.79 15.93,30.73 16.59,30.73 v16.61,30.71 | D4.A 21.59,29.45 v21.59,29.21
  Bottom 0.178: J2.12 v21.59,29.21 21.16,29.64 21.01,29.79 20.22,30.58 17.03,30.58 16.9,30.71 v16.61,30.71
12  (via drill 0.25)
  Top 0.178: U2.18 7.14,35.12 v6.46,35.8
  Bottom 0.178: J1.8 2.45,20.23 2.45,22.3 2.78,22.63 2.78,24.7 3.11,25.03 3.11,27.1 3.44,27.43 3.44,29.5 3.79,29.84 3.79,31.9 4.14,32.26 4.14,34.77 5.17,35.8 v6.46,35.8
13  (via drill 0.25)
  Top 0.178: U2.20 8.29,34.33 6.16,32.19 4.81,32.19 v4.29,31.67
  Bottom 0.178: v4.29,31.67 4.12,31.5 4.12,29.7 3.77,29.36 3.77,27.29 3.44,26.96 3.44,24.89 3.11,24.56 3.11,22.49 2.78,22.16 2.78,20.09 2.45,19.76 2.45,17.69 J1.7
14  (via drill 0.25)
  Top 0.178: U2.17 7.68,35.52 v7.04,36.17
  Bottom 0.178: J1.9 2.45,22.77 2.45,24.84 2.78,25.17 2.78,27.24 3.11,27.57 3.11,29.64 3.45,29.98 3.45,32.04 3.81,32.4 3.81,34.95 5.21,36.35 6.86,36.35 v7.04,36.17
15  (via drill 0.25)
  Top 0.178: U2.21 8.4,33.92 7.47,32.99 7.47,30.99 v7.73,30.72
  Bottom 0.178: J2.11 19.05,26.67 13.45,32.27 9.94,32.27 9.8,32.41 8.8,32.41 8.22,31.83 7.86,31.83 7.47,31.43 7.47,30.99 v7.73,30.72
16  (via drill 0.25)
  Top 0.178: U2.25 9.87,30.6 v9.82,30.56
  Bottom 0.178: v9.82,30.56 9.82,29.19 10.72,28.3 12.88,28.3 14.2,26.98 14.2,26.42 15.02,25.59 17.77,25.59 18.34,25.02 19.24,25.02 22.17,22.09 22.17,20.07 22.62,19.62 22.62,17.55 22.95,17.22 22.95,15.15 J2.6
17  (via drill 0.25)
  Top 0.178: U2.27 10.66,29.11 v10.95,28.83
  Bottom 0.178: v10.95,28.83 11.12,28.65 13.01,28.65 14.53,27.13 14.53,26.56 15.16,25.92 17.91,25.92 18.48,25.35 19.42,25.35 22.5,22.26 22.5,20.21 22.95,19.76 22.95,17.69 J2.7
18  (via drill 0.25)
  Top 0.178: U2.35 13.87,31.37 14.12,31.11 16,31.11 v16.13,31.24
  Bottom 0.178: J2.13 22.85,31.75 22.01,30.91 17.4,30.91 17.07,31.24 v16.13,31.24
19  (via drill 0.25)
  Top 0.178: U2.38 15.61,33.12 16.27,32.46 v16.27,32.35
  Bottom 0.178: J2.15 22.95,35.65 22.95,32.79 21.73,31.57 17.68,31.57 16.9,32.35 v16.27,32.35
21  (via drill 0.25)
  Top 0.178: U2.42 15.57,34.73 15.7,34.59 16.13,34.59 16.59,35.05 v16.59,35.08
  Bottom 0.178: J2.19 22.95,45.81 22.95,43.74 22.62,43.41 22.62,41.34 21.96,40.68 21.96,36.54 21.63,36.21 21.63,34.15 20.55,33.07 18.59,33.07 v16.59,35.08
22  (via drill 0.25)
  Top 0.178: U2.39 15.7,33.52 16.26,32.97 v16.51,32.97
  Bottom 0.178: J2.16 22.95,38.19 22.95,36.12 22.62,35.79 22.62,32.93 21.59,31.9 17.82,31.9 16.75,32.97 v16.51,32.97 16.54,32.97
23  (via drill 0.25)
  Top 0.178: U2.36 14.27,31.53 14.33,31.47 15.54,31.47 15.82,31.75 v16.56,31.75
  Bottom 0.178: v16.56,31.75 17.03,31.75 17.54,31.24 21.87,31.24 24.13,33.5 J2.14
25  (via drill 0.25)
  Top 0.178: U2.14 8.65,36.73 8.23,37.15 8.23,37.59 7.85,37.97 v7.58,37.97
  Bottom 0.178: v7.58,37.97 7.33,38.23 5.56,38.23 2.81,35.47 2.81,32.8 2.46,32.46 2.46,30.4 J1.12
26  (via drill 0.25)
  Top 0.178: U2.15 8.58,36.33 7.39,37.52 v7.06,37.52
  Bottom 0.178: v7.06,37.52 5.36,37.52 3.14,35.29 3.14,32.66 2.79,32.32 2.79,30.26 2.45,29.92 2.45,27.85 J1.11
27  (via drill 0.25)
  Top 0.178: U2.16 8.51,35.92 7.59,36.84 v7.04,36.84
  Bottom 0.178: v7.04,36.84 5.19,36.84 3.48,35.13 3.48,32.54 3.12,32.18 3.12,30.12 2.78,29.78 2.78,27.71 2.45,27.38 2.45,25.31 J1.10
32K_XN
  Top 0.178: U2.13 8.72,37.12 8.57,37.27 8.57,37.88 7.98,38.48 7.09,38.48 6.79,38.19 5.64,38.19 | 6.18,36.85 Y2.P$2 | 5.64,38.19 2.63,38.19 J1.15 | Y2.P$2 5.64,36.85 5.64,38.19 | C26.2 5.71,35.98 Y2.P$2
32K_XP
  Top 0.178: U2.12 9.87,38.33 9.78,38.42 8.52,38.42 8.1,38.84 6.96,38.84 6.67,38.54 5.71,38.54 | 5.71,38.54 2.1,38.54 J1.16 | 5.71,38.54 Y2.P$1 5.71,40.22 C9.2
34  (via drill 0.25)
  Top 0.178: U2.10 10.66,38.47 10.06,39.08 8.8,39.08 8.13,39.75 7.62,39.75 v7.47,39.9
  Bottom 0.178: v7.47,39.9 6.25,39.9 1.27,34.92 J1.14
35  (via drill 0.25)
  Top 0.178: U2.11 10.27,38.4 9.92,38.75 8.66,38.75 8.06,39.34 v7.07,39.34
  Bottom 0.178: v7.07,39.34 6.17,39.34 2.46,35.64 2.46,32.94 J1.13
36  (via drill 0.25)
  Top 0.178: C1.2 5.04,49.15 1.65,49.15 J1.20 | U2.5 12.66,38.47 12.55,38.58 12.55,39.18 12.69,39.32 12.69,39.92 v12.48,40.12
  Bottom 0.178: v12.48,40.12 12.39,40.12 2.98,49.53 J1.20
37  (via drill 0.25)
  Top 0.178: C1.1 5.04,47.37 1.65,47.37 J1.19 | U2.6 12.27,38.41 12.21,38.47 12.21,39.5 v12.17,39.53
  Bottom 0.178: J1.19 5.02,46.99 11.89,40.12 11.89,39.81 v12.17,39.53
38  (via drill 0.25)
  Top 0.178: C2.1 1.69,44.03 J1.18 | U2.7 11.87,38.68 11.51,39.04 v11.51,39.46
  Bottom 0.178: J1.18 7.09,44.45 11.51,40.03 v11.51,39.46
39  (via drill 0.25)
  Top 0.178: C2.2 1.69,42.33 J1.17 | U2.8 11.46,38.61 10.85,39.23 v10.85,39.47
  Bottom 0.178: J1.17 9.12,41.91 10.85,40.18 v10.85,39.47
CAP_10N
  Top 0.178: C5.2 C27.1 R2.2 17.63,40.7 17.63,40.13 17.12,39.62 16.1,39.62 15.76,39.28 15.76,37.4 15.48,37.12 U2.48
CHIP_PU  (via drill 0.25)
  Top 0.178: S1.3 S1.4 6.77,43.62 R1.1 8.13,40.55 v8.13,40.26 8.98,39.41 10.2,39.41 11.06,38.54 U2.9 | Q2.3 15.86,20.34 v15.24,20.95 | v8.33,23.82 7.82,24.33 5.71,24.33 5.28,24.77 5.28,25.72 v4.1,26.9
  Bottom 0.178: v15.24,20.95 12.7,23.5 8.66,23.5 v8.33,23.82 | J1.6 2.45,15.15 2.45,17.22 2.79,17.56 2.79,19.63 3.11,19.95 3.11,22.02 3.44,22.35 3.44,24.42 3.77,24.75 3.77,26.57 v4.1,26.9 4.1,29.17 4.45,29.52 4.45,31.11 4.79,31.46 4.79,31.89 4.47,32.21 4.47,34.59 5.16,35.28 6.86,35.28 7.56,35.98 7.56,37.21 8.1,37.76 8.1,40.23 v8.13,40.26
D+
  Top 0.178: JP15.D+ 7.62,5.71 8.08,6.17 9.73,6.17 10.16,6.6 R14.1 C13.1
D-
  Top 0.178: JP15.D- 6.97,5.7 7.77,6.5 8.72,6.5 8.89,6.67 R13.1 C12.1
DTR
  Top 0.178: U4.1 12.65,18.1 13.35,17.4 16.26,17.4 16.87,16.79 19.14,16.79 19.81,17.46 19.81,19.75 19.66,19.9 R17.1 18.98,19.97 Q2.1
FLASH_SCK
  Top 0.178: U2.31 12.27,30.53 12.72,30.07 15.98,30.07 16.32,29.73 17,29.73 17.14,29.59 U5.6
FLASH_SCS  (via drill 0.25)
  Top 0.178: U2.30 11.87,30.22 v12.04,30.05 | U5.1 14.61,26.16 v15.37,26.92
  Bottom 0.178: v15.37,26.92 15.37,27.3 12.62,30.05 v12.04,30.05
FLASH_SDI
  Top 0.178: U2.33 13.06,31.18 13.84,30.4 16.2,30.4 16.55,30.06 18.1,30.06 18.41,29.74 U5.5
FLASH_SDO  (via drill 0.25)
  Top 0.178: U2.32 12.66,30.84 v12.8,30.71 | U5.2 v15.88,27.38
  Bottom 0.178: v12.8,30.71 12.8,30.45 v15.88,27.38
FLASH_SHD
  Top 0.178: U5.7 15.88,29.55 15.68,29.74 13.61,29.74 12.8,28.93 11.91,28.93 11.06,29.78 U2.28
FLASH_SWP  (via drill 0.25)
  Top 0.178: v17.14,26.42 U5.3 | U2.29 11.46,29.91 11.94,29.44 v12.39,29.44
  Bottom 0.178: v12.39,29.44 12.72,29.44 14.86,27.3 14.86,26.7 15.14,26.42 v17.14,26.42
FLASH_VDD  (via drill 0.25)
  Top 0.178: C24.1 9.82,30.06 | 9.82,30.06 v9.82,27.33 | U2.26 10.27,31.34 10.32,31.28 10.32,30.34 10.05,30.06 9.82,30.06
  Bottom 0.178: SJ3.1 10.3,26.85 v9.82,27.33
GND  (via drill 0.25)
  Top 0.178: U4.16 4.98,20.64 C14.2 | 10,50.72 7.8,50.72 | JP15.GND 8.92,5.43
  Top 0.203: v8.52,3.48 8.8,3.48 8.91,3.59 8.91,4.74
  Top 0.406: C18.2 16.93,42.12 17.4,42.6
  Top 0.762: E1.GND 10,50.72 | 7.8,50.72 E1.GND2
  other vias: 11.4,10.19 6.99,10.22 15.16,11.19 14.22,8.32 19.05,11.43 8.99,16.26 12.45,21.27 8.32,19.11 4.47,19 4.39,39.41 7.7,27.37 5.66,32.74 7.04,30.61 5.63,31.64 10.79,34.92 10.79,36.2 12.06,36.2 13.34,36.2 13.34,34.92 13.34,33.66 12.06,33.66 10.79,33.66 2.98,37.64 7.62,50.93 6.35,50.93 5.08,50.93 3.81,50.93 2.54,50.93 1.27,50.93 8.89,50.93 10.16,50.93 12.19,50.93 13.46,50.93 14.73,50.93 16,50.93 17.27,50.93 18.54,50.93 19.81,50.93 21.08,50.93 23.62,50.93 24.89,50.93 10.54,49.91 12.95,49.91 11.56,47.88 14.1,47.88 13.46,48.77 11.81,46.61 13.97,46.61 11.81,45.34 13.97,45.34 13.97,44.07 13.97,42.8 12.45,41.53 16.51,20.83 14.1,23.43 19.28,22.29 10.54,46.61 10.54,45.34 10.54,47.88 8.89,49.66 7.62,49.66 6.35,49.66 14.22,49.91 14.73,48.77 15.37,47.88 15.24,46.61 15.24,45.34 15.24,44.07 16,49.66 17.27,49.66 18.54,49.66 19.81,49.66 21.08,49.66 21.56,27.47 20.45,38.1 20.57,42.55 19.25,35.53 12.06,34.92 10.03,14.58 11.49,6.4 12,5.87 20.07,23.43 20.24,33.58 19.99,29.83 9.25,41.02 5.66,26.11 8.26,25.22 10.06,21.31 4.45,16.61 6.45,12.85 11.61,12.78 20.65,9.6 12.7,24.8 10.16,43.21 7.92,30.04 16.61,37.49
  pour Top (isolate 0.178, rank 6): 0,58.93 0,0 25.4,0 25.4,58.93
  pour Bottom (isolate 0.178, rank 6): 25.4,58.93 25.4,0 0,0 0,58.93
LNA_IN
  Top 0.178: L1.1 12.9,43.83 | U2.2 13.87,39.2
  Top 0.762: L1.1 12.91,42.37 13.87,41.42 13.87,39.2 | 12.9,43.83 C8.1
N$1
  Top 0.178: R8.2 20.32,26.92 20.95,27.56 D4.C
N$2
  Top 0.178: D3.A R4.2
N$3  (via drill 0.25)
  Top 0.178: R4.1 v13.34,7.8
  Bottom 0.178: v13.34,7.8 12.83,7.29 SJ2.1
N$4
  Top 0.178: C27.2 R2.1 17.79,39.79 17.27,39.27 16.29,39.27 16.12,39.09 16.12,37.25 15.59,36.73 U2.47
N$7  (via drill 0.25)
  Top 0.178: U4.12 v7.11,23.18 | R13.2 v8.89,11.43
  Bottom 0.178: v7.11,23.18 7.11,13.21 v8.89,11.43
N$8  (via drill 0.25)
  Top 0.178: U4.11 v7.62,23.81 | R14.2 v10.16,11.43
  Bottom 0.178: v7.62,23.81 7.62,13.97 v10.16,11.43
N$9  (via drill 0.25)
  Top 0.178: U1.1 16.2,12.38 v15.6,12.98 | v16.26,8.38 16.26,2.3 D1.C
  Bottom 0.178: v15.6,12.98 16.26,12.32 v16.26,8.38
N$10
  Top 0.178: Q2.5 16.51,17.65 17.02,17.14 18.8,17.14 19.05,17.4 R17.2
N$11  (via drill 0.25)
  Top 0.178: U5.8 14.61,27.65 14.48,27.52 C17.1 11.21,26.04 v10.39,26.04
  Bottom 0.178: v10.39,26.04 SJ3.2
N$12
  Top 0.178: Q2.2 16.51,19.43 16.38,19.3 15.62,19.3 15.03,19.9 R18.2
N$13
  Top 0.178: C3.2 17.57,36.76 Y1.1 16.73,35.92 U2.45
N$14
  Top 0.178: R5.2 19.08,12.77 U1.5
  Bottom 0.178: SJ1.2 R5.2
N$15
  Top 0.178: C4.2 19.27,34.36 Y1.3 18.09,35.59 15.57,35.59 15.51,35.52 U2.44
N$16  (via drill 0.25)
  Top 0.178: R6.2 v19.27,15.88
  Bottom 0.178: SJ1.1 17.91,15.37 18.41,15.88 v19.27,15.88
N$17
  Top 0.178: D1.A R3.2
RTS
  Top 0.178: U4.2 12.64,18.73 13.17,18.2 R18.1 14.04,18.13 Q2.4
SHIELD  (via drill 0.51)
  other vias: 7.62,1.97 3.94,1.97 11.3,1.97
  pour Top (isolate 0.305): 3.17,2.6 3.17,0 12.06,0 12.06,2.6
  pour Bottom (isolate 0.305): 12.06,2.6 12.06,0 3.17,0 3.17,2.6
TRACE_ANT
  Top 0.178: E1.ANT 11.18,51.1
  Top 0.762: 11.18,51.1 arc46 11.71,49.94 arc-35 L2.1 arc33 12.75,47.88 arc-37 12.88,47.57 12.88,47.23 C8.2
U0RXD  (via drill 0.25)
  Top 0.178: U4.20 v9.53,18.1 | U2.40 16.27,33.92 v16.54,33.66 | v21.79,32.88 22.62,32.05 22.62,22.75 21.11,21.23 v20.17,21.23
  Bottom 0.178: v9.53,18.1 12,20.57 12.64,20.57 13.14,20.07 19,20.07 v20.17,21.23 | J2.17 22.62,40.4 22.62,36.26 22.29,35.93 22.29,33.38 v21.79,32.88 | v21.79,32.88 21.14,32.23 17.96,32.23 v16.54,33.66 | 21.96,33.05 v21.79,32.88
U0TXD  (via drill 0.25)
  Top 0.178: U4.4 v12.38,20 | U2.41 15.5,34.33 15.56,34.27 16.51,34.27 v16.57,34.33 | v20.68,21.74 22.29,23.36 22.29,31.39 v20.94,32.74
  Bottom 0.178: v12.38,20 12.7,19.68 19.33,19.68 20.68,21.03 v20.68,21.74 | J2.18 22.95,43.27 22.95,41.2 22.29,40.54 22.29,36.4 21.96,36.07 21.96,33.76 v20.94,32.74 18.16,32.74 v16.57,34.33
V_BATT  (via drill 0.25)
  Top 0.178: 18.05,8.51 C6.1 | U1.3 v17.78,10.48
  Top 0.457: JP2.2 18.05,8.51 v17.14,8.51 | Q1.3 14.44,14.45 v15.15,13.74
  Bottom 0.457: J1.3 9.56,6.35 11.86,4.05 18.01,4.05 | v17.14,8.51 17.14,9.85 v17.78,10.48 17.78,12.95 17.09,13.64 15.25,13.64 v15.15,13.74 | J2.3 21.83,4.05 18.01,4.05 | JP2.2 18.05,4.09 18.01,4.05
V_USB  (via drill 0.25)
  Top 0.178: 20.95,10.48 C19.1 | U4.15 4.98,21.27 C14.1 C15.1
  Top 0.305: U4.15 7.18,21.27 10.16,18.29 10.16,17.4 10.54,17.02 12.57,17.02 13.27,16.32 v13.27,15.55
  Top 0.457: F1.2 5.84,10.93 6.99,12.06 D2.A 12.82,10.46 R7.2 v13.12,9.11 15.24,9.11 | Q1.1 v13.27,15.55 | 15.24,9.11 16.6,9.11 17.02,9.53 19.68,9.53 20.07,9.91 20.07,10.48 | 20.07,10.48 U1.4 | 20.07,10.48 20.95,10.48 | R3.1 15.24,9.11
  Bottom 0.457: v13.27,15.55 13.27,9.26 v13.12,9.11
VIN
  Top 0.178: 10.74,13.65 C7.1 | 12.29,13.71 Q1.2
  Top 0.457: U3.3 7.93,15.55 7.75,15.37 7.75,13.97 8.06,13.65 U3.1 10.74,13.65 | C7.1 12.29,13.71 | Q1.2 13.53,13.65 D2.C
VUSB-RAW
  Top 0.178: 6.35,6.99 C11.1 6.32,7.38
  Top 0.406: JP15.VBUS 6.32,6.35
  Top 0.457: 4.45,6.35 F1.1 | 6.32,7.38 6.32,6.35 4.45,6.35 | 4.45,6.35 3.81,6.35 J1.2
  Bottom 0.457: J2.2 23.69,3.37 11.6,3.37 9.69,5.27 2.73,5.27 J1.2

### Text on the board
Bottom: v10
tPlace: ESP32 Thing | 36 | GND | RST | 0 | 37 | 21 | 38 | TX | 39 | RX | 32 | 22 | 33 | 19 | 34 | 23 | 35 | 18 | 25 | 5 | 26 | 15 | 27 | 2 | 14 | 0 | 12 | 4 | 13 | 17 | !RST! | 16 | 3V3 | 3V3 | GND | GND | VBAT | P | C
bPlace: ESP32 Thing | http://sfe.io/t5O7 | 36 | GND | 37 | 21 | 38 | TXO | 39 | RXI | 32 | 22 | 33 | 19 | 34 | 23 | 35 | 18 | 25 | 5 | IC | 26 | 15 | FLASH / VCC | 3V3 | 27 | 2 | 14 | 0 | 12 | 4 | 13 | 17 | CHG / PROG | !RST! | 16 | 3V3 | 3V3 | GND | GND | VBAT | VBAT | PWR / LED | VUSB | VUSB | GND | GND
tDocu: Jim Lindblom